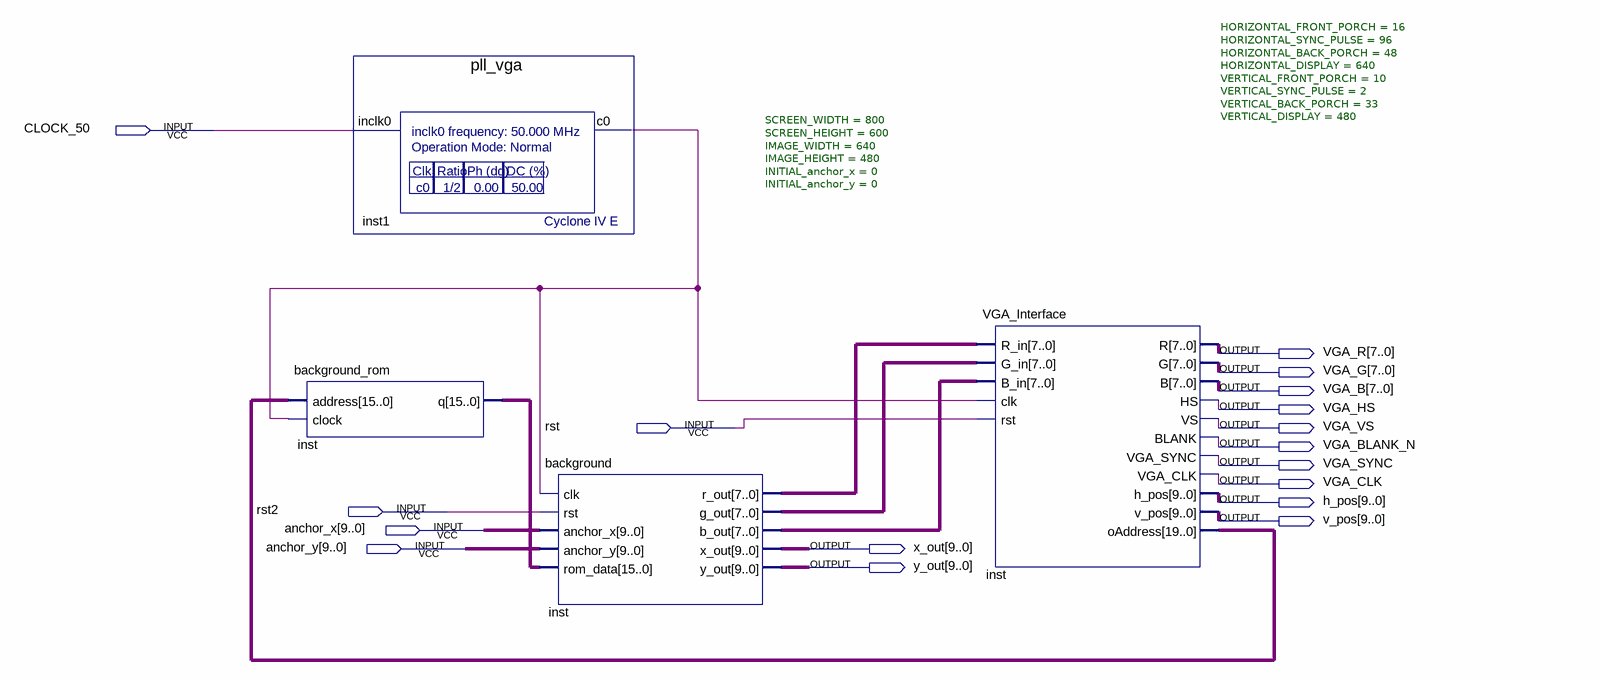
[diagram p0: schematic sheet]
// Quartus schematic vga.bdf as structural Verilog: 4 symbols, 17 pins
module vga (
  input  CLOCK_50,
  input  rst,
  input  rst2,
  input  [9:0] anchor_x,
  input  [9:0] anchor_y,
  output [7:0] VGA_R,
  output [7:0] VGA_G,
  output [7:0] VGA_B,
  output VGA_HS,
  output VGA_VS,
  output VGA_BLANK_N,
  output VGA_SYNC,
  output VGA_CLK,
  output [9:0] h_pos,
  output [9:0] v_pos,
  output [9:0] x_out,
  output [9:0] y_out
);

  wire inst1_c0;
  wire [7:0] inst_b_out, inst_g_out, inst_r_out;
  wire [15:0] inst_q;
  wire [19:0] inst_oaddress;

  background_rom inst (.address(inst_oaddress), .clock(inst1_c0), .q(inst_q));
  pll_vga inst1 (.inclk0(CLOCK_50), .c0(inst1_c0));
  background #(.SCREEN_WIDTH(800), .SCREEN_HEIGHT(600), .IMAGE_WIDTH(640), .IMAGE_HEIGHT(480), .INITIAL_anchor_x(0), .INITIAL_anchor_y(0)) inst_dup2 (
    .clk(inst1_c0), .rst(rst2), .anchor_x(anchor_x), .anchor_y(anchor_y), .rom_data(inst_q),
    .r_out(inst_r_out), .g_out(inst_g_out), .b_out(inst_b_out), .x_out(x_out), .y_out(y_out));
  VGA_Interface #(.HORIZONTAL_FRONT_PORCH(16), .HORIZONTAL_SYNC_PULSE(96), .HORIZONTAL_BACK_PORCH(48), .HORIZONTAL_DISPLAY(640), .VERTICAL_FRONT_PORCH(10), .VERTICAL_SYNC_PULSE(2), .VERTICAL_BACK_PORCH(33), .VERTICAL_DISPLAY(480)) inst_dup3 (
    .R_in(inst_r_out), .G_in(inst_g_out), .B_in(inst_b_out), .clk(inst1_c0), .rst(rst), .R(VGA_R), .G(VGA_G),
    .B(VGA_B), .HS(VGA_HS), .VS(VGA_VS), .BLANK(VGA_BLANK_N), .VGA_SYNC(VGA_SYNC), .VGA_CLK(VGA_CLK),
    .h_pos(h_pos), .v_pos(v_pos), .oAddress(inst_oaddress));
endmodule
